# Altium schematic sheet INT_REVA.SchDoc
size A; SheetNumber: 1; SheetTotal: 1
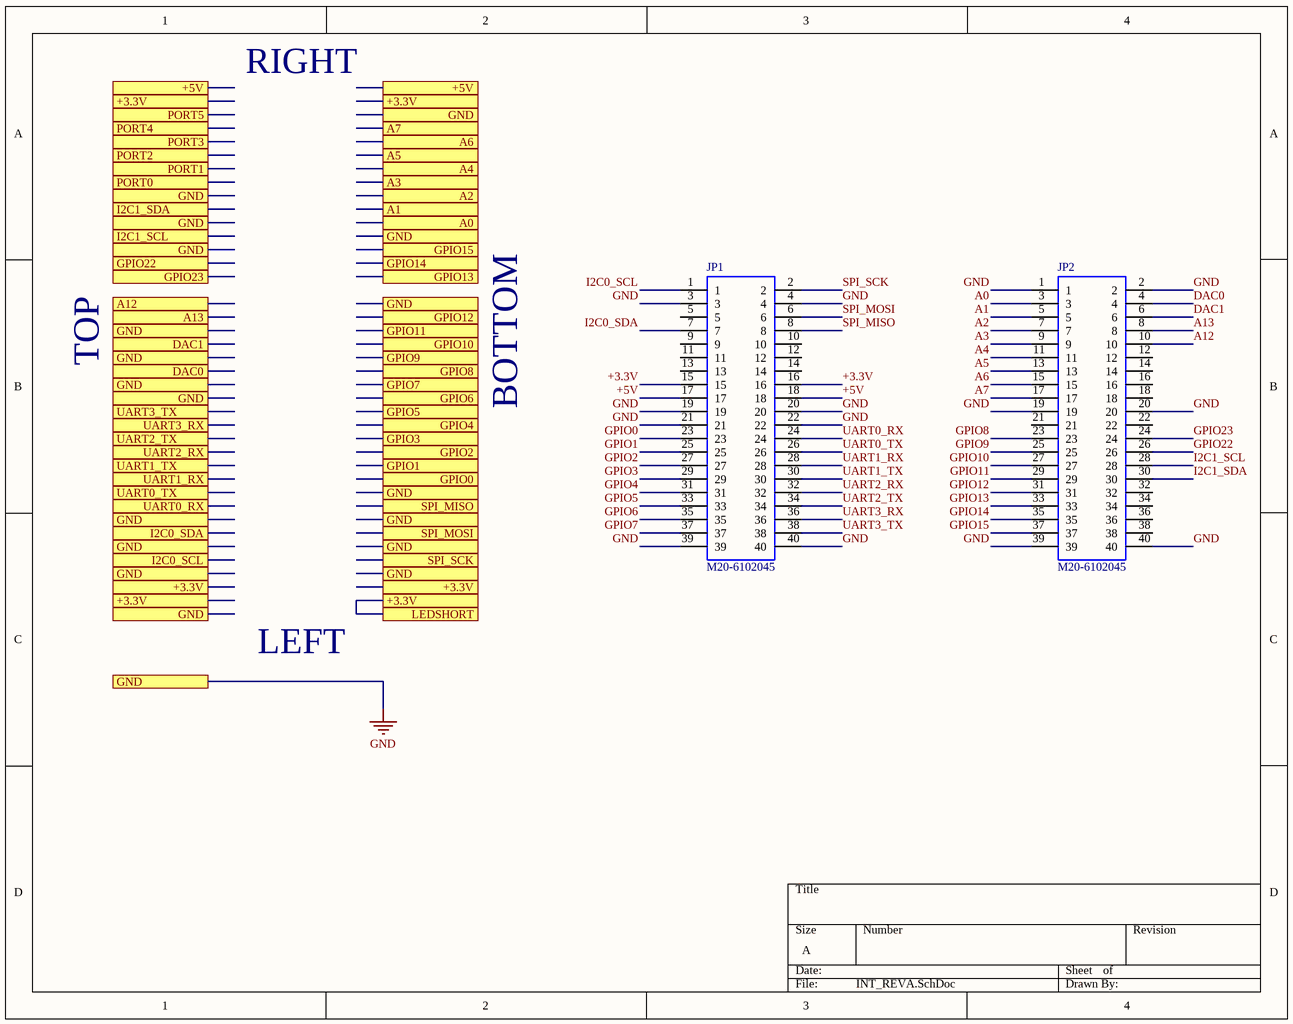
[diagram p0: INT_REVA.SchDoc]

## Parts
JP1  M20-6102045  [RHDR40W66P254_2X20_5146X500X1105P]
JP2  M20-6102045  [RHDR40W66P254_2X20_5146X500X1105P]

## Ports
+3.3V (see INT_REVA[1A], INT_REVA[1C], INT_REVA[2A], INT_REVA[2C]), +3.3V (see INT_REVA[1A], INT_REVA[1C], INT_REVA[2C]), +3.3V (see INT_REVA[1C], INT_REVA[2A], INT_REVA[2C]), +5V (see INT_REVA[1A]), +5V (see INT_REVA[2A]), A0, A1, A2, A3, A4, A5, A6, A7, A12, A13, DAC0, DAC1, GND (see INT_REVA[1A], INT_REVA[1B], INT_REVA[1C], INT_REVA[2A], INT_REVA[2B], INT_REVA[2C]), GPIO0, GPIO1, GPIO2, GPIO3, GPIO4, GPIO5, GPIO6, GPIO7, GPIO8, GPIO9, GPIO10, GPIO11, GPIO12, GPIO13, GPIO14, GPIO15, GPIO22, GPIO23, I2C0_SCL, I2C0_SDA, I2C1_SCL, I2C1_SDA, LEDSHORT, PORT0, PORT1, PORT2, PORT3, PORT4, PORT5, SPI_MISO, SPI_MOSI, SPI_SCK, UART0_RX, UART0_TX, UART1_RX, UART1_TX, UART2_RX, UART2_TX, UART3_RX, UART3_TX

## Nets
GND: JP1.3 JP1.4 JP1.19 JP1.20 JP1.21 JP1.22 JP1.39 JP1.40 JP2.1 JP2.2 JP2.19 JP2.20 JP2.39 JP2.40 ; port GND
+3.3V: JP1.15 JP1.16
+3.3V: port +3.3V, port LEDSHORT  [a separate net that carries the same name]
+5V: JP1.17 JP1.18
A0: JP2.3
A1: JP2.5
A2: JP2.7
A3: JP2.9
A4: JP2.11
A5: JP2.13
A6: JP2.15
A7: JP2.17
A12: JP2.10
A13: JP2.8
DAC0: JP2.4
DAC1: JP2.6
GPIO0: JP1.23
GPIO1: JP1.25
GPIO2: JP1.27
GPIO3: JP1.29
GPIO4: JP1.31
GPIO5: JP1.33
GPIO6: JP1.35
GPIO7: JP1.37
GPIO8: JP2.23
GPIO9: JP2.25
GPIO10: JP2.27
GPIO11: JP2.29
GPIO12: JP2.31
GPIO13: JP2.33
GPIO14: JP2.35
GPIO15: JP2.37
GPIO22: JP2.26
GPIO23: JP2.24
I2C0_SCL: JP1.1
I2C0_SDA: JP1.7
I2C1_SCL: JP2.28
I2C1_SDA: JP2.30
SPI_MISO: JP1.8
SPI_MOSI: JP1.6
SPI_SCK: JP1.2
UART0_RX: JP1.24
UART0_TX: JP1.26
UART1_RX: JP1.28
UART1_TX: JP1.30
UART2_RX: JP1.32
UART2_TX: JP1.34
UART3_RX: JP1.36
UART3_TX: JP1.38

Not connected (* = marked no-connect by the designer): JP1 5 9 10 11 12 13 14; JP2 12 14 16 18 21 22 32 34 36 38

## Notes on the sheet
- RIGHT
- TOP
- BOTTOM
- LEFT

## Library data of the parts
JP1 JP2 = M20-6102045: PC / 104 Connectors PC104 STACK CONNECT 20+20 HI TEMP AU; Manufacturer_Name: Harwin; Geometry.Height: 11.05mm; Manufacturer_Part_Number: M20-6102045; Mouser Part Number: 855-M20-6102045; Mouser Price/Stock: https://www.mouser.co.uk/ProductDetail/Harwin/M20-6102045?qs=pYcASEcTDE4FwHXnSlfG3Q%3D%3D; Arrow Part Number: *; Arrow Price/Stock: *; Mouser Testing Part Number: *; Mouser Testing Price/Stock: *; Datasheet Link: https://datasheet.datasheetarchive.com/originals/distributors/SFDatasheet-1/sf-00022539.pdf